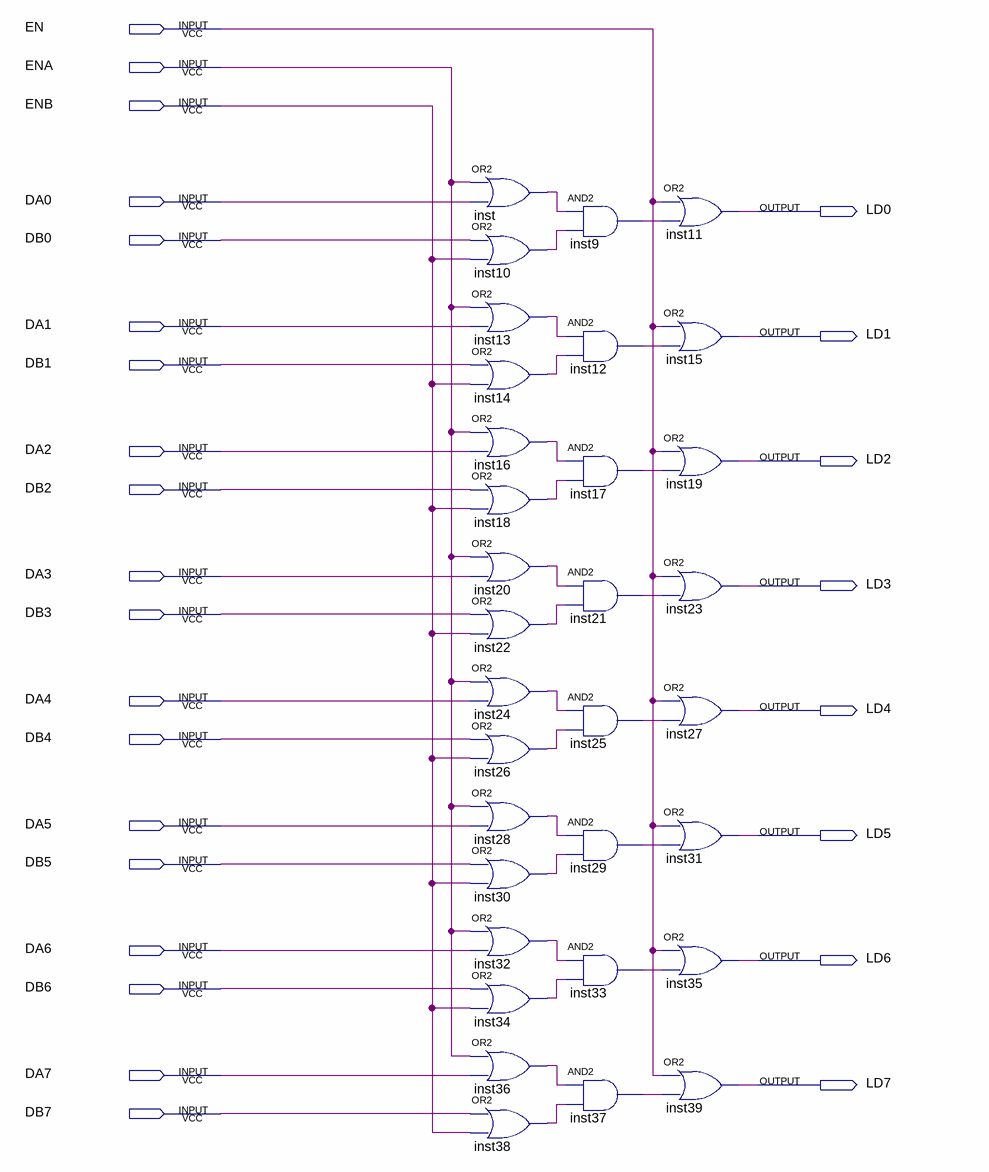
[diagram p0: schematic sheet]
// Quartus schematic 16bufer8.bdf as structural Verilog: 32 symbols, 27 pins
module \16bufer8  (
  input  EN,
  input  ENA,
  input  ENB,
  input  DA0,
  input  DB0,
  input  DA1,
  input  DB1,
  input  DA2,
  input  DB2,
  input  DA3,
  input  DB3,
  input  DA4,
  input  DB4,
  input  DA5,
  input  DB5,
  input  DA6,
  input  DB6,
  input  DA7,
  input  DB7,
  output LD0,
  output LD1,
  output LD2,
  output LD3,
  output LD4,
  output LD5,
  output LD6,
  output LD7
);

  wire inst9_out, inst10_out, inst12_out, inst13_out, inst14_out, inst16_out, inst17_out, inst18_out,
       inst20_out, inst21_out, inst22_out, inst24_out, inst25_out, inst26_out, inst28_out, inst29_out,
       inst30_out, inst32_out, inst33_out, inst34_out, inst36_out, inst37_out, inst38_out, inst_out;

  or inst (inst_out, ENA, DA0);
  or inst10 (inst10_out, DB0, ENB);
  or inst13 (inst13_out, ENA, DA1);
  or inst14 (inst14_out, DB1, ENB);
  or inst16 (inst16_out, ENA, DA2);
  or inst18 (inst18_out, DB2, ENB);
  or inst20 (inst20_out, ENA, DA3);
  or inst22 (inst22_out, DB3, ENB);
  or inst24 (inst24_out, ENA, DA4);
  or inst26 (inst26_out, DB4, ENB);
  or inst28 (inst28_out, ENA, DA5);
  or inst30 (inst30_out, DB5, ENB);
  or inst32 (inst32_out, ENA, DA6);
  or inst34 (inst34_out, DB6, ENB);
  or inst36 (inst36_out, ENA, DA7);
  or inst38 (inst38_out, DB7, ENB);
  and inst9 (inst9_out, inst_out, inst10_out);
  and inst12 (inst12_out, inst13_out, inst14_out);
  and inst17 (inst17_out, inst16_out, inst18_out);
  and inst21 (inst21_out, inst20_out, inst22_out);
  and inst25 (inst25_out, inst24_out, inst26_out);
  and inst29 (inst29_out, inst28_out, inst30_out);
  and inst33 (inst33_out, inst32_out, inst34_out);
  and inst37 (inst37_out, inst36_out, inst38_out);
  or inst11 (LD0, EN, inst9_out);
  or inst15 (LD1, EN, inst12_out);
  or inst19 (LD2, EN, inst17_out);
  or inst23 (LD3, EN, inst21_out);
  or inst27 (LD4, EN, inst25_out);
  or inst31 (LD5, EN, inst29_out);
  or inst35 (LD6, EN, inst33_out);
  or inst39 (LD7, EN, inst37_out);
endmodule
